# Altium schematic sheet Bus_master_Sheet.SchDoc
size A4
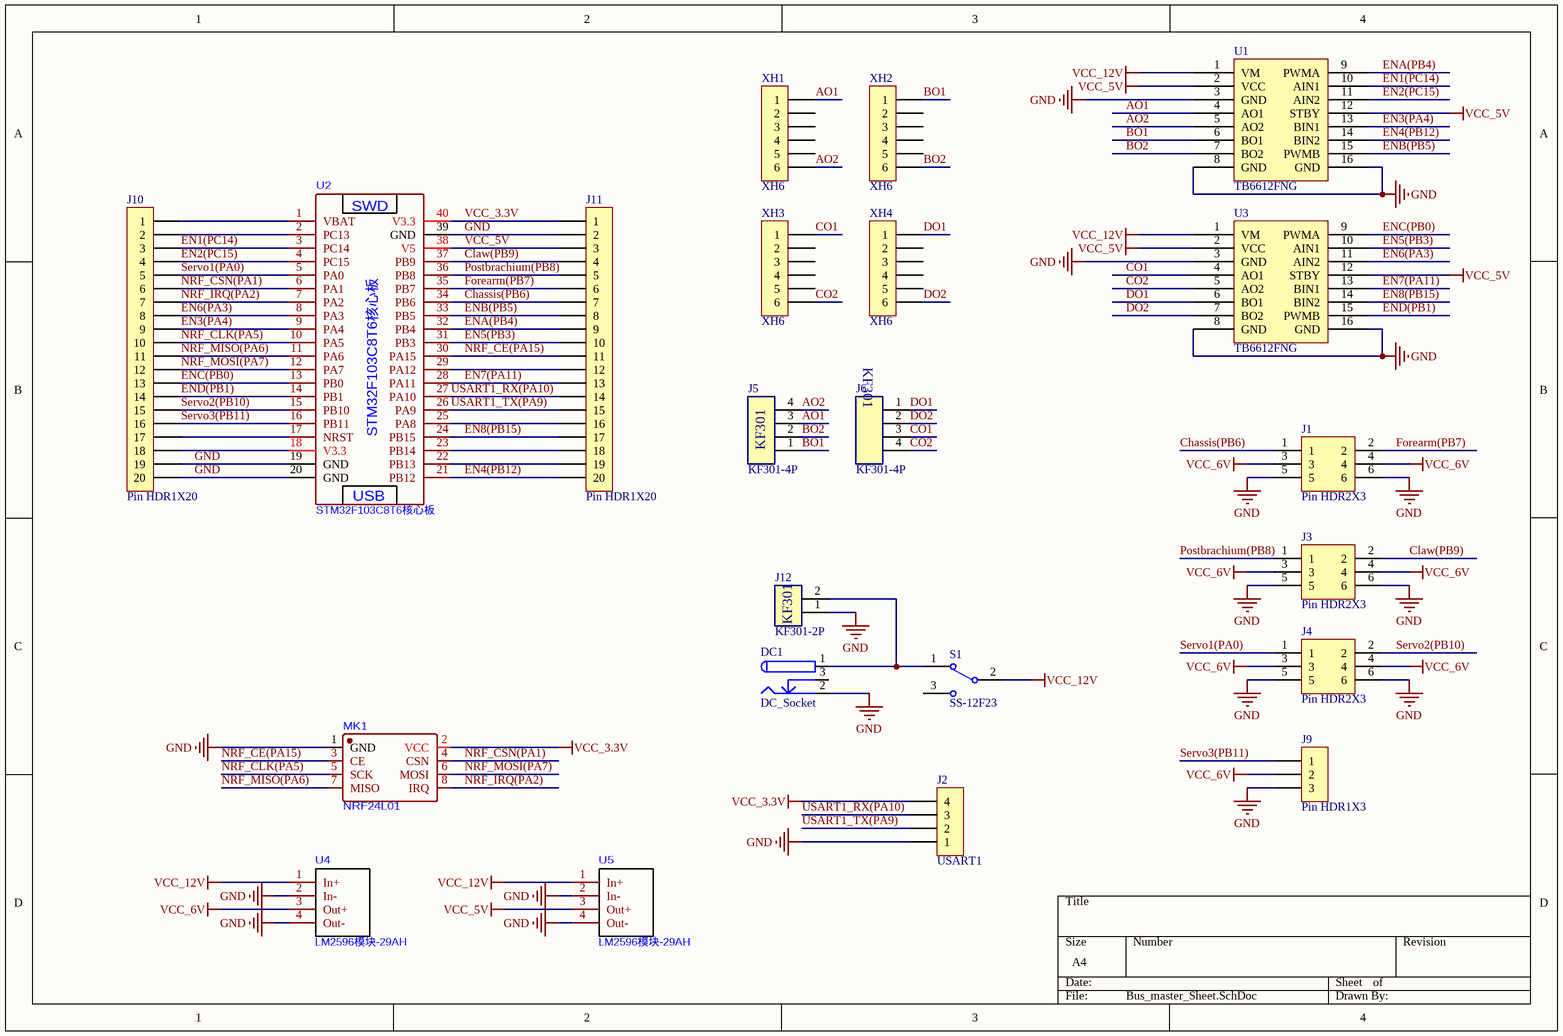
[diagram p0: Bus_master_Sheet.SchDoc]

## Parts
DC1  DC_Socket  [DC-005]
J1  Pin HDR2X3  [Pin HDR2X3/2.54mm-S]
J2  USART1  [Pin HDR1X4/2.54mm-W]
J3  Pin HDR2X3  [Pin HDR2X3/2.54mm-S]
J4  Pin HDR2X3  [Pin HDR2X3/2.54mm-S]
J5  KF301-4P  [KF301-5.0-4P]
J6  KF301-4P  [KF301-5.0-4P]
J9  Pin HDR1X3  [Pin HDR1X3/2.54mm-S]
J10  Pin HDR1X20  [Pin HDR1X20/2.54mm-S]
J11  Pin HDR1X20  [Pin HDR1X20/2.54mm-S]
J12  KF301-2P  [KF301-5.0-2P]
MK1  NRF24L01  [WIRELM-SMD_NRF24L01]
S1  SS-12F23  [SS-12F23]
U1  TB6612FNG  [TB6612]
U2  STM32F103C8T6核心板  [STM32F103C8T6]
U3  TB6612FNG  [TB6612]
U4  LM2596模块-29AH  [LM2596]
U5  LM2596模块-29AH  [LM2596]
XH1  XH6  [XH6/2.54mm/90]
XH2  XH6  [XH6/2.54mm/90]
XH3  XH6  [XH6/2.54mm/90]
XH4  XH6  [XH6/2.54mm/90]

## Nets
GND: DC1.2 J1.5 J1.6 J2.1 J3.5 J3.6 J4.5 J4.6 J9.3 J10.19 J10.20 J11.2 J12.1 MK1.1(GND) U1.3(GND) U1.8(GND) U1.16(GND) U2.19(GND) U2.20(GND) U2.39(GND) U3.3(GND) U3.8(GND) U3.16(GND) U4.2(In-) U4.4(Out-) U5.2(In-) U5.4(Out-)
VCC_3.3V: J2.4 J11.1 MK1.2(VCC) U2.40(V3.3)
VCC_5V: J11.3 U1.2(VCC) U1.12(STBY) U2.38(V5) U3.2(VCC) U3.12(STBY) U5.3(Out+)
VCC_6V: J1.3 J1.4 J3.3 J3.4 J4.3 J4.4 J9.2 U4.3(Out+)
VCC_12V: S1.2 U1.1(VM) U3.1(VM) U4.1(In+) U5.1(In+)
AO1: J5.3 U1.4(AO1) XH1.1
AO2: J5.4 U1.5(AO2) XH1.6
BO1: J5.1 U1.6(BO1) XH2.1
BO2: J5.2 U1.7(BO2) XH2.6
Chassis(PB6): J1.1 J11.7 U2.34(PB6)
Claw(PB9): J3.2 J11.4 U2.37(PB9)
CO1: J6.3 U3.4(AO1) XH3.1
CO2: J6.4 U3.5(AO2) XH3.6
DO1: J6.1 U3.6(BO1) XH4.1
DO2: J6.2 U3.7(BO2) XH4.6
EN1(PC14): J10.3 U1.10(AIN1) U2.3(PC14)
EN2(PC15): J10.4 U1.11(AIN2) U2.4(PC15)
EN3(PA4): J10.9 U1.13(BIN1) U2.9(PA4)
EN4(PB12): J11.20 U1.14(BIN2) U2.21(PB12)
EN5(PB3): J11.10 U2.31(PB3) U3.10(AIN1)
EN6(PA3): J10.8 U2.8(PA3) U3.11(AIN2)
EN7(PA11): J11.13 U2.28(PA11) U3.13(BIN1)
EN8(PB15): J11.17 U2.24(PB15) U3.14(BIN2)
ENA(PB4): J11.9 U1.9(PWMA) U2.32(PB4)
ENB(PB5): J11.8 U1.15(PWMB) U2.33(PB5)
ENC(PB0): J10.13 U2.13(PB0) U3.9(PWMA)
END(PB1): J10.14 U2.14(PB1) U3.15(PWMB)
Forearm(PB7): J1.2 J11.6 U2.35(PB7)
NRF_CE(PA15): J11.11 MK1.3(CE) U2.30(PA15)
NRF_CLK(PA5): J10.10 MK1.5(SCK) U2.10(PA5)
NRF_CSN(PA1): J10.6 MK1.4(CSN) U2.6(PA1)
NRF_IRQ(PA2): J10.7 MK1.8(IRQ) U2.7(PA2)
NRF_MISO(PA6): J10.11 MK1.7(MISO) U2.11(PA6)
NRF_MOSI(PA7): J10.12 MK1.6(MOSI) U2.12(PA7)
Postbrachium(PB8): J3.1 J11.5 U2.36(PB8)
Servo1(PA0): J4.1 J10.5 U2.5(PA0)
Servo2(PB10): J4.2 J10.15 U2.15(PB10)
Servo3(PB11): J9.1 J10.16 U2.16(PB11)
USART1_RX(PA10): J2.3 J11.14 U2.27(PA10)
USART1_TX(PA9): J2.2 J11.15 U2.26(PA9)
NetDC1_1: DC1.1 J12.2 S1.1
NetJ10_1: J10.1 U2.1(VBAT)
NetJ10_2: J10.2 U2.2(PC13)
NetJ10_17: J10.17 U2.17(NRST)
NetJ10_18: J10.18 U2.18(V3.3)
NetJ11_12: J11.12 U2.29(PA12)
NetJ11_16: J11.16 U2.25(PA8)
NetJ11_18: J11.18 U2.23(PB14)
NetJ11_19: J11.19 U2.22(PB13)

Not connected (* = marked no-connect by the designer): DC1 3; S1 3; XH1 2 3 4 5; XH2 2 3 4 5; XH3 2 3 4 5; XH4 2 3 4 5

## Notes on the sheet
- (in symbol KF301-2P) KF301
- (in symbol KF301-4P) KF301
- (in symbol STM32F103C8T6核心板) SWD; USB

## Library data of the parts
J2 = Pin HDR1X4